# EAGLE design 4WaySwitch (EAGLE 4.13)
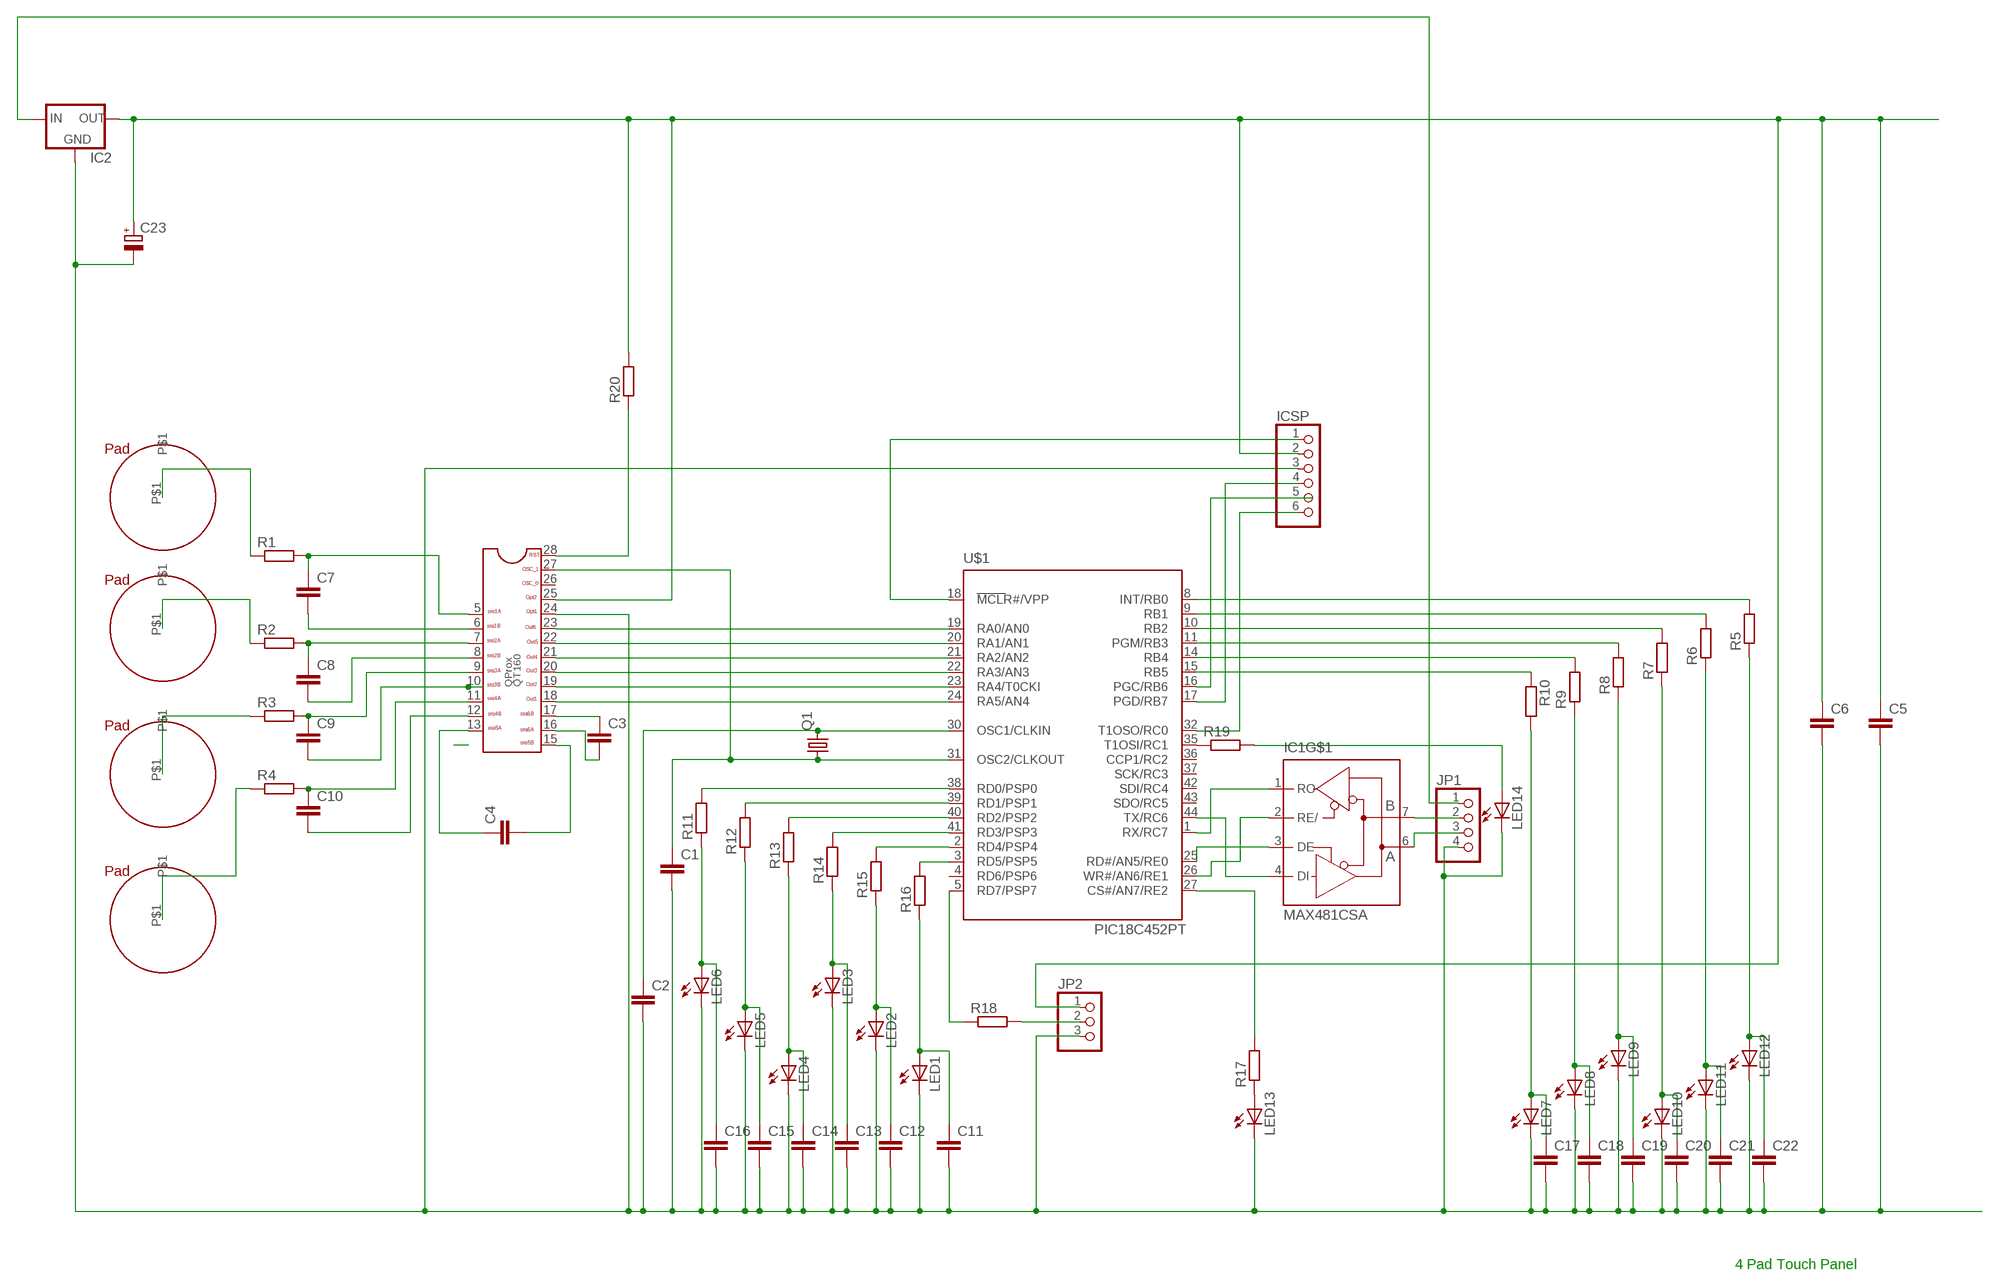
[diagram p0: schematic, sheet 1]

## Parts
C1  C-EUC0805  [C0805]
C2  C-EUC0805  [C0805]
C3  C-EUC0805  [C0805]
C4  C-EUC0805  [C0805]
C5  C-EUC0805  [C0805]
C6  C-EUC0805  [C0805]
C7  C-EUC0805  [C0805]
C8  C-EUC0805  [C0805]
C9  C-EUC0805  [C0805]
C10  C-EUC0805  [C0805]
C11  C-EUC1206  [C1206]
C12  C-EUC1206  [C1206]
C13  C-EUC1206  [C1206]
C14  C-EUC1206  [C1206]
C15  C-EUC1206  [C1206]
C16  C-EUC1206  [C1206]
C17  C-EUC1206  [C1206]
C18  C-EUC1206  [C1206]
C19  C-EUC1206  [C1206]
C20  C-EUC1206  [C1206]
C21  C-EUC1206  [C1206]
C22  C-EUC1206  [C1206]
C23  CPOL-EUD/7343-31W  [D/7343-31W]
IC1  MAX481CSA  [SO08]
IC2  78LXX  [78LXX]
ICSP  PINHD-1X6  [1X06]
JP1  PINHD-1X4  [1X04]
JP2  PINHD-1X3  [1X03]
LED1  LEDSMT1206  [1206]
LED2  LEDSMT1206  [1206]
LED3  LEDCHIPLED_1206  [CHIPLED_1206]
LED4  LEDCHIPLED_1206  [CHIPLED_1206]
LED5  LEDCHIPLED_1206  [CHIPLED_1206]
LED6  LEDCHIPLED_1206  [CHIPLED_1206]
LED7  LEDSMT1206  [1206]
LED8  LEDSMT1206  [1206]
LED9  LEDSMT1206  [1206]
LED10  LEDSMT1206  [1206]
LED11  LEDSMT1206  [1206]
LED12  LEDSMT1206  [1206]
LED13  LED5MM  [LED5MM]
LED14  LEDSMT1206  [1206]
Q1  CRYTALHC49S  [HC49/S]
R1  R-EU_R0805  [R0805]
R2  R-EU_R0805  [R0805]
R3  R-EU_R0805  [R0805]
R4  R-EU_R0805  [R0805]
R5  R-EU_R0805  [R0805]
R6  R-EU_R0805  [R0805]
R7  R-EU_R0805  [R0805]
R8  R-EU_R0805  [R0805]
R9  R-EU_R0805  [R0805]
R10  R-EU_R0805  [R0805]
R11  R-EU_R0805  [R0805]
R12  R-EU_R0805  [R0805]
R13  R-EU_R0805  [R0805]
R14  R-EU_R0805  [R0805]
R15  R-EU_R0805  [R0805]
R16  R-EU_R0805  [R0805]
R17  R-EU_R1206  [R1206]
R18  R-EU_R1210  [R1210]
R19  R-EU_M1206  [M1206]
R20  R-EU_M1206  [M1206]
U$1  PIC18C452PT  [TQFP44]
U$2  QPROX160  [SSOP28]
U$3  PAD  [PAD1]
U$4  PAD  [PAD1]
U$5  PAD  [PAD1]
U$6  PAD  [PAD1]

## Nets
GND: C1.2 C2.2 C5.2 C6.2 C11.2 C12.2 C13.2 C14.2 C15.2 C16.2 C17.2 C18.2 C19.2 C20.2 C21.2 C22.2 C23.- IC2.GND ICSP.3 JP1.4 JP2.3 LED1.C LED2.C LED3.C LED4.C LED5.C LED6.C LED7.C LED8.C LED9.C LED10.C LED11.C LED12.C LED13.K(C) LED14.C U$2.24(OPT1)
N$1: IC1.4(DI) U$1.44(TX/RC6)
N$2: IC1.1(RO) U$1.1(RX/RC7)
N$3: IC1.3(DE) U$1.25(RD#/AN5/RE0)
N$4: IC1.2(RE/) U$1.26(WR#/AN6/RE1)
N$5: U$1.19(RA0/AN0) U$2.23(OUT6)
N$6: U$1.20(RA1/AN1) U$2.22(OUT5)
N$7: U$1.21(RA2/AN2) U$2.21(OUT4)
N$8: U$1.22(RA3/AN3) U$2.20(OUT3)
N$9: U$1.23(RA4/T0CKI) U$2.19(OUT2)
N$10: U$1.24(RA5/AN4) U$2.18(OUT1)
N$11: C2.1 Q1.2 U$1.30(OSC1/CLKIN)
N$12: C1.1 Q1.1 U$1.31(OSC2/CLKOUT) U$2.27(OSCI)
N$13: C3.1 U$2.17(SNS6B)
N$14: C3.2 U$2.16(SNS6A)
N$15: C4.2 U$2.15(SNS5B)
N$16: C4.1 U$2.13(SNS5A)
N$17: R11.2 U$1.38(RD0/PSP0)
N$18: R12.2 U$1.39(RD1/PSP1)
N$19: C7.1 R1.2 U$2.5(SNS1A)
N$20: C7.2 U$2.6(SNS1B)
N$21: C8.1 R2.2 U$2.7(SNS2A)
N$22: C8.2 U$2.8(SNS2B)
N$23: C9.1 R3.2 U$2.9(SNS3A)
N$24: C9.2 U$2.10(SNS3B)
N$25: C10.1 R4.2 U$2.11(SNS4A)
N$26: C10.2 U$2.12(SNS4B)
N$27: R5.2 U$1.8(INT/RB0)
N$28: R6.2 U$1.9(RB1)
N$29: R7.2 U$1.10(RB2)
N$30: R8.2 U$1.11(PGM/RB3)
N$31: R9.2 U$1.14(RB4)
N$32: R10.1 U$1.15(RB5)
N$33: R13.2 U$1.40(RD2/PSP2)
N$34: R14.2 U$1.41(RD3/PSP3)
N$35: R15.2 U$1.2(RD4/PSP4)
N$36: R16.2 U$1.3(RD5/PSP5)
N$37: C11.1 LED1.A R16.1
N$38: C12.1 LED2.A R15.1
N$39: C16.1 LED6.A R11.1
N$40: C15.1 LED5.A R12.1
N$41: C14.1 LED4.A R13.1
N$42: C13.1 LED3.A R14.1
N$43: C17.1 LED7.A R10.2
N$44: C18.1 LED8.A R9.1
N$45: C19.1 LED9.A R8.1
N$46: C20.1 LED10.A R7.1
N$47: C21.1 LED11.A R6.1
N$48: C22.1 LED12.A R5.1
N$49: ICSP.1 U$1.18(MCLR#/VPP)
N$50: R3.1 U$5.P$1
N$51: R1.1 U$3.P$1
N$52: U$1.16(PGC/RB6)
N$53: ICSP.4 U$1.17(PGD/RB7)
N$54: ICSP.6 U$1.32(T1OSO/RC0)
N$55: R2.1 U$4.P$1
N$56: R4.1 U$6.P$1
N$58: IC1.6(A) JP1.3
N$59: IC1.7(B) JP1.2
N$60: R20.1 U$2.28(RST)
N$61: LED13.A R17.1
N$62: R17.2 U$1.27(CS#/AN7/RE2)
N$65: JP2.2 R18.2
N$66: R18.1 U$1.5(RD7/PSP7)
N$67: R19.1 U$1.35(T1OSI/RC1)
N$68: LED14.A R19.2
VCC: C5.1 C6.1 C23.+ IC2.OUT ICSP.2 JP2.1 R20.2 U$2.25(OPT2)
VDD: IC2.IN JP1.1
Unconnected: ICSP.5 U$1.4(RD6/PSP6) U$1.36(CCP1/RC2) U$1.37(SCK/RC3) U$1.42(SDI/RC4) U$1.43(SDO/RC5) U$2.26(OSCO)

## Notes on the sheet
- 4 Pad Touch Panel

## Power pins joined to a net without a drawn wire
GND: IC1.5(GND) U$1.7(GND) U$1.28(GND) U$2.1(GND) U$2.2(GND) U$2.14(GND)
VCC: U$1.6(VCC) U$1.29(VCC) U$2.3(VCC) U$2.4(VCC)
VDD: IC1.8(VDD)

## Library data of the parts
C1-C22 = rcl:C-EU: CAPACITOR, European symbol
C23 = rcl:CPOL-EU: POLARIZED CAPACITOR, European symbol
IC1 = maxim:MAX481CSA: RS485 TRANSEIVER
IC2 = v-reg:78LXX: VOLTAGE REGULATOR
ICSP = pinhead:PINHD-1X6: PIN HEADER
JP1 = pinhead:PINHD-1X4: PIN HEADER
JP2 = pinhead:PINHD-1X3: PIN HEADER
LED1-LED14 = led:LED: LED OSRAM: - CHIPLED LG R971, LG N971, LY N971, LG Q971, LY Q971, LO R971, LY R971 LH N974, LH R974 LS Q976, LO Q976, LY Q976 LO Q996 - Hyper CHIPLED LW Q18S LB Q993, LB Q99A, LB R99A - SideLED LS A670, LO A670, LY A670, LG A670, LP A670 LB A673, LV A673, LT A673, LW A673 LH A674 LY A675 LS A676, LA A676, LO A676, LY A676, LW A676 LS A679, LY A679, LG A679 - Hyper Micro SIDELED® LS Y876, LA Y876, LO Y876, LY Y876 LT Y87S - SmartLED LW L88C, LW L88S LB L89C, LB L89S, LG L890 LS L89K, LO L89K, LY L89K LS L896, LA L896, LO L896, LY L896 - TOPLED LS T670, LO T670, LY T670, LG T670, LP T670 LSG T670, LSP T670, LSY T670, LOP T670, LYG T670 LG T671, LOG T671, LSG T671 LB T673, LV T673, LT T673, LW T673 LH T674 LS T676, LA T676, LO T676, LY T676, LB T676, LH T676, LSB T676, LW T676 LB T67C, LV T67C, LT T67C, LS T67K, LO T67K, LY T67K, LW E67C LS E67B, LA E67B, LO E67B, LY E67B, LB E67C, LV E67C, LT E67C LW T67C LS T679, LY T679, LG T679 LS T770, LO T770, LY T770, LG T770, LP T770 LB T773, LV T773, LT T773, LW T773 LH T774 LS E675, LA E675, LY E675, LS T675 LS T776, LA T776, LO T776, LY T776, LB T776 LHGB T686 LT T68C, LB T68C - Hyper Mini TOPLED® LB M676 - Mini TOPLED Santana® LG M470 LS M47K, LO M47K, LY M47K Source: http://www.osram.convergy.de/
Q1 = crystal:CRYTAL: CRYSTAL
R1-R20 = rcl:R-EU_: RESISTOR, European symbol
U$1 = micro-pic18xxx:PIC18C4*2?: High-Performance Microcontrollers with 10-Bit A/D
U$2 = QProx:QPROX160
U$3-U$6 = QProx:PAD

## Board
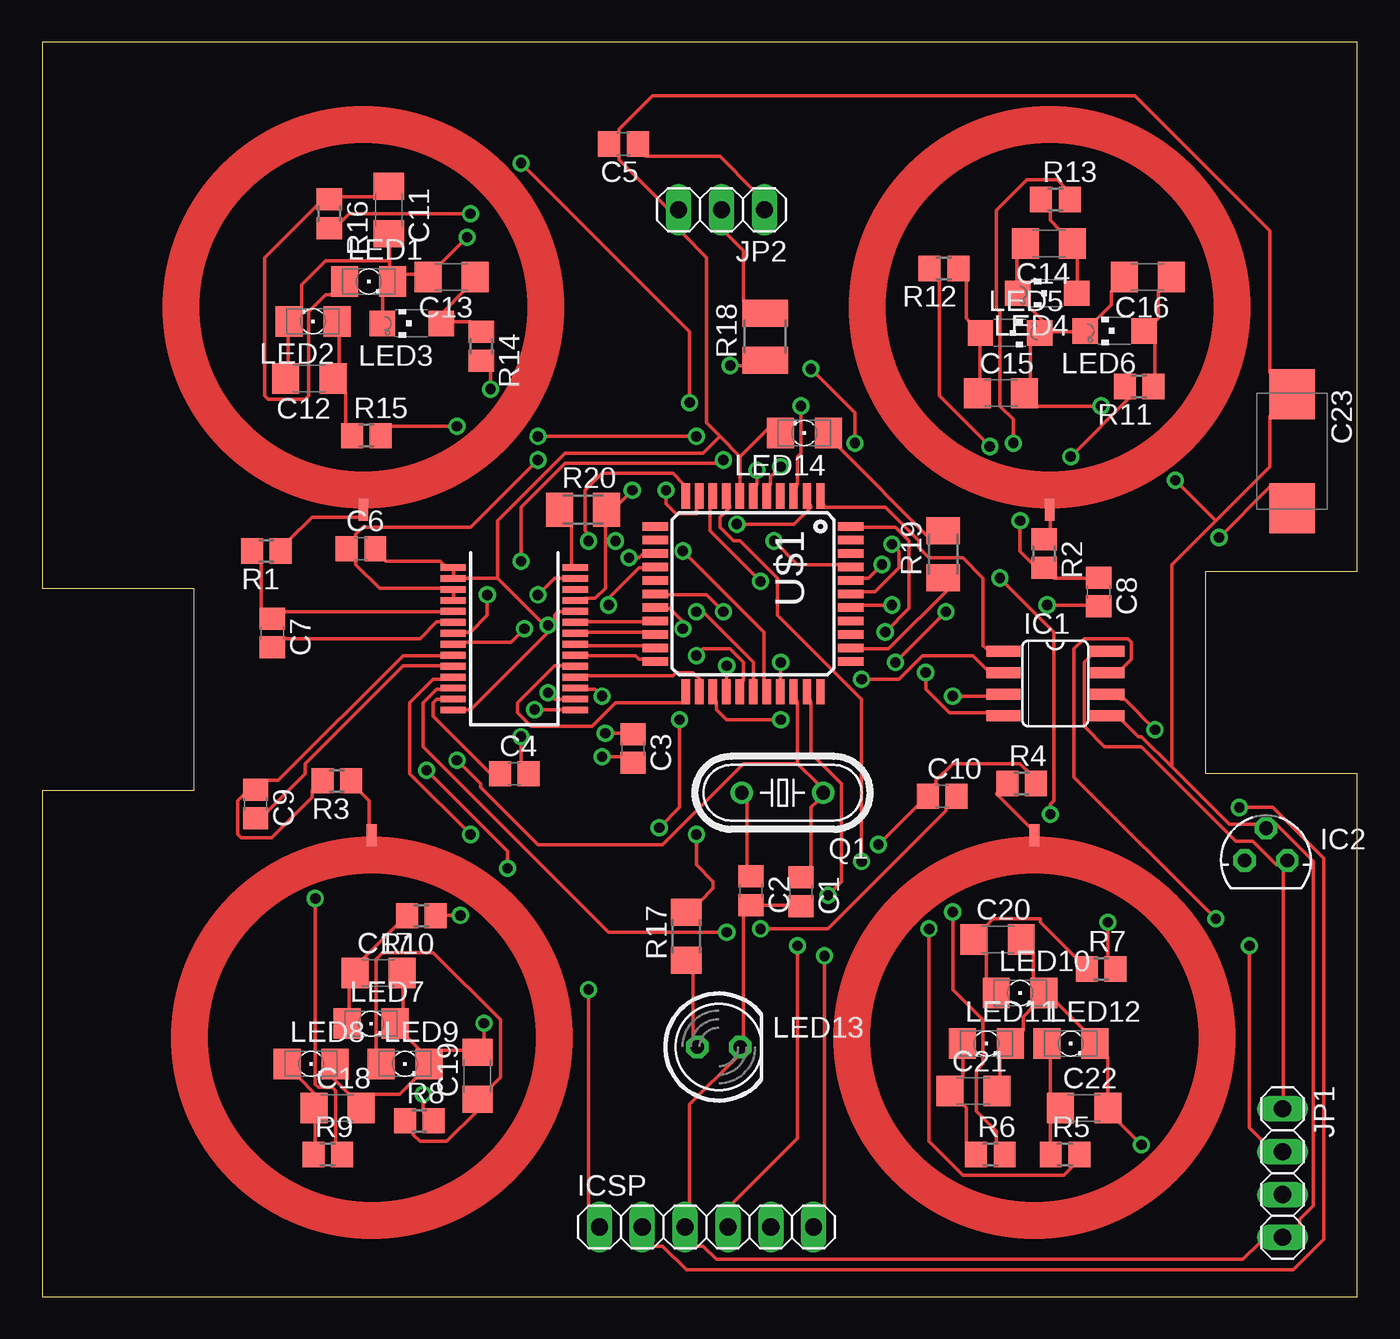
[diagram p1: board, top side]
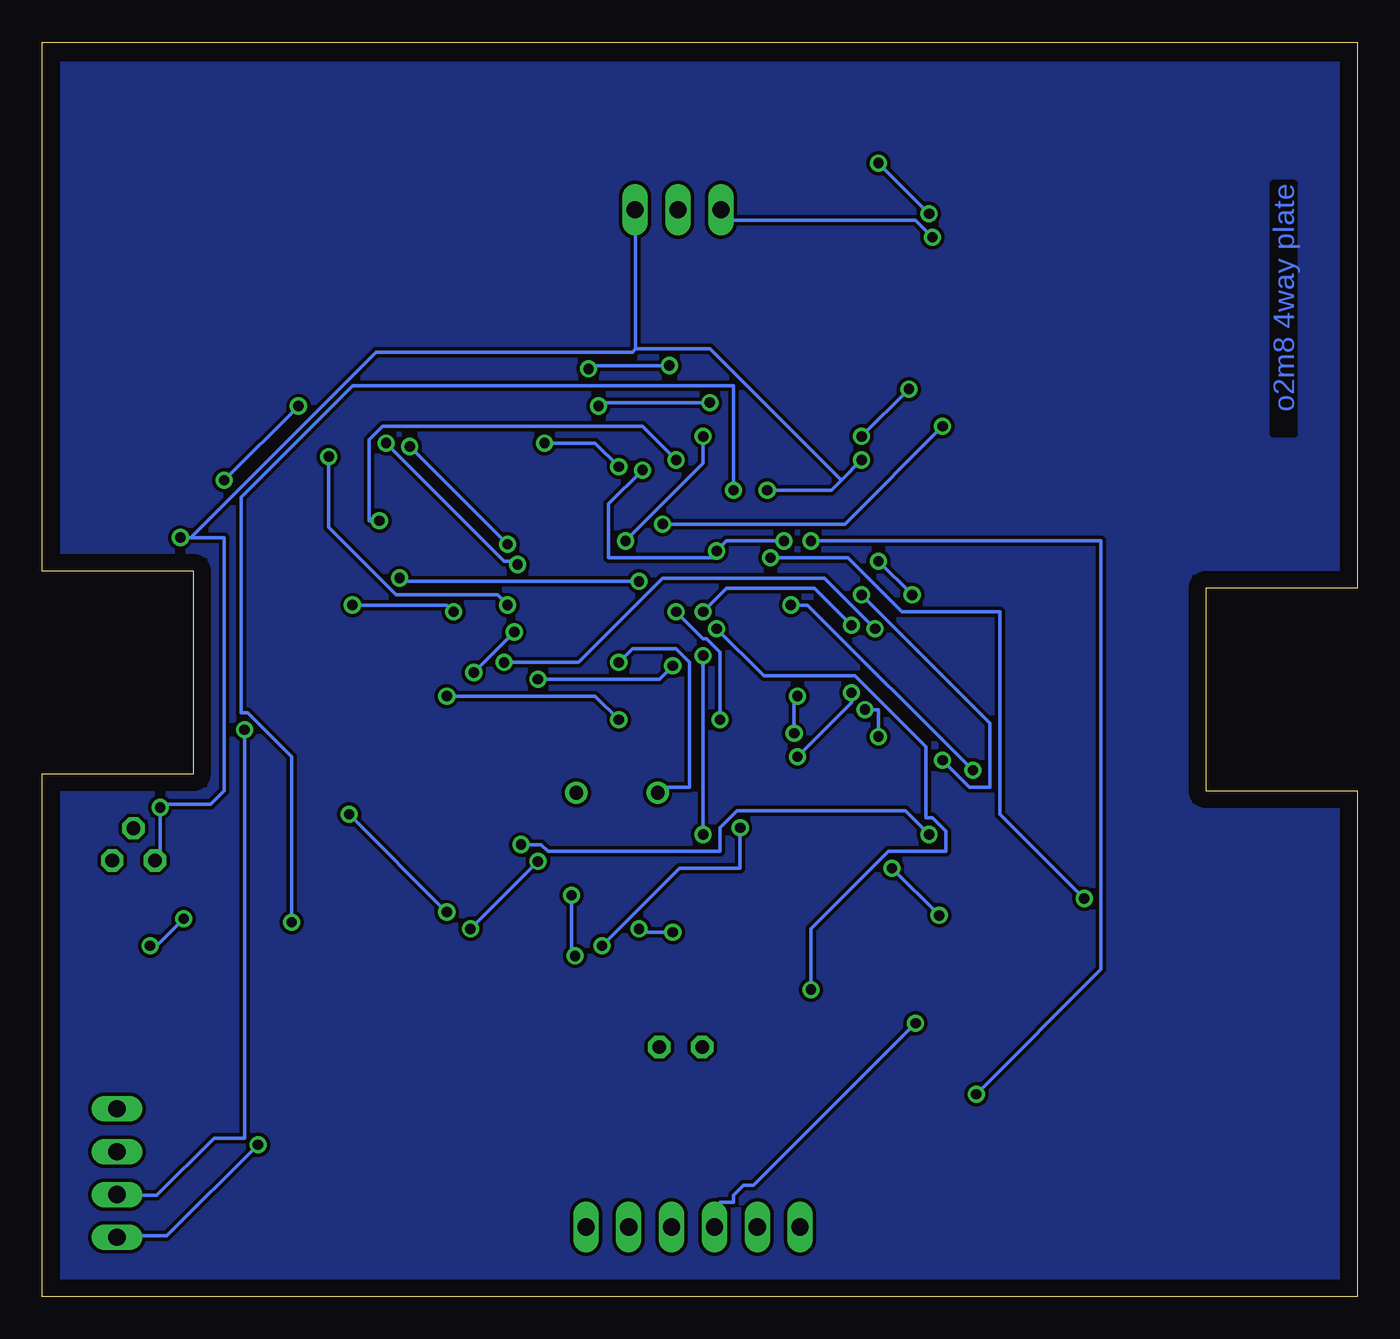
[diagram p2: board, bottom side, seen from below]

Size 78 x 74.37 mm. Coordinates in mm from the lower left corner, seen from the top.
Outline: 0,74.37 78,74.37 78,43 69,43 69,31 78,31 78,0 0,0 0,30 9,30 9,42 0,42 0,74.37
Outline: 0.53,74.37 0,74.37
Copper layers (1*16): Top 0.035mm / dielectric 1.5mm / Bottom 0.035mm
Design rules "default": minimum track width 8mil, minimum drill 24mil, track to track 8mil, track to pad 8mil, pad to pad 8mil, via to via 8mil, smd to smd 8mil, copper to edge 40mil, drill to drill 8mil, minimum pad ring 10mil, minimum via ring 8mil, stop-mask expansion 4mil, vias tented up to drill 0mil, thermal gap 10mil

### Footprints (pad centres in the part's own frame; a part is rotated, then mirrored left to right if it is on the bottom)
C0805 = smd 1.3 x 1.5: 1 -0.85,0; 2 0.85,0
C1206 = smd 1.6 x 1.8: 1 -1.4,0; 2 1.4,0
D/7343-31W = smd 2.95 x 2.7: + 3.375,0; - -3.375,0
SO08 = smd 0.66 x 2.032: 1 -1.905,-3.073; 2 -0.635,-3.073; 3 0.635,-3.073; 4 1.905,-3.073; 5 1.905,3.073; 6 0.635,3.073; 7 -0.635,3.073; 8 -1.905,3.073
78LXX = drill 0.813 octagon: GND 0,1.905; IN 1.27,0; OUT -1.27,0
1X06 = drill 1.016 long: 1 -6.35,0; 2 -3.81,0; 3 -1.27,0; 4 1.27,0; 5 3.81,0; 6 6.35,0
1X04 = drill 1.016 long: 1 -3.81,0; 2 -1.27,0; 3 1.27,0; 4 3.81,0
1X03 = drill 1.016 long: 1 -2.54,0; 2 0,0; 3 2.54,0
1206 = smd 1.6 x 1.803: A -1.422,0; C 1.422,0
CHIPLED_1206 = smd 1.5 x 1.5: A 0,-1.75; C 0,1.75
LED5MM = drill 0.813 octagon: A -1.27,0; K 1.27,0
HC49/S = drill 0.813 round: 1 -2.413,0; 2 2.413,0
R0805 = smd 1.3 x 1.5: 1 -0.85,0; 2 0.85,0
R1206 = smd 1.6 x 1.803: 1 -1.422,0; 2 1.422,0
R1210 = smd 1.6 x 2.7: 1 -1.4,0; 2 1.4,0
M1206 = smd 1.6 x 2: 1 -1.4,0; 2 1.4,0
TQFP44 = smd 1.5 x 0.5: 1 -5.8,4; 2 -5.8,3.2; 3 -5.8,2.4; 4 -5.8,1.6; 5 -5.8,0.8; 6 -5.8,0; 7 -5.8,-0.8; 8 -5.8,-1.6; 9 -5.8,-2.4; 10 -5.8,-3.2; 11 -5.8,-4; 23 5.8,-4; 24 5.8,-3.2; 25 5.8,-2.4; 26 5.8,-1.6; 27 5.8,-0.8; 28 5.8,0; 29 5.8,0.8; 30 5.8,1.6; 31 5.8,2.4; 32 5.8,3.2; 33 5.8,4 | smd 0.5 x 1.5: 12 -4,-5.8; 13 -3.2,-5.8; 14 -2.4,-5.8; 15 -1.6,-5.8; 16 -0.8,-5.8; 17 0,-5.8; 18 0.8,-5.8; 19 1.6,-5.8; 20 2.4,-5.8; 21 3.2,-5.8; 22 4,-5.8; 34 4,5.8; 35 3.2,5.8; 36 2.4,5.8; 37 1.6,5.8; 38 0.8,5.8; 39 0,5.8; 40 -0.8,5.8; 41 -1.6,5.8; 42 -2.4,5.8; 43 -3.2,5.8; 44 -4,5.8
SSOP28 = smd 0.4 x 1.5: 1 -4.225,-3.625; 2 -3.575,-3.625; 3 -2.925,-3.625; 4 -2.275,-3.625; 5 -1.625,-3.625; 6 -0.975,-3.625; 7 -0.325,-3.625; 8 0.325,-3.625; 9 0.975,-3.625; 10 1.625,-3.625; 11 2.275,-3.625; 12 2.925,-3.625; 13 3.575,-3.625; 14 4.225,-3.625; 15 4.225,3.625; 16 3.575,3.625; 17 2.925,3.625; 18 2.275,3.625; 19 1.625,3.625; 20 0.975,3.625; 21 0.325,3.625; 22 -0.325,3.625; 23 -0.975,3.625; 24 -1.625,3.625; 25 -2.275,3.625; 26 -2.925,3.625; 27 -3.575,3.625; 28 -4.225,3.625
PAD1 = smd 0.635 x 1.27: P$1 0,12

### Placement (x,y rotation side)
C1  45,24 270 top
C2  42.04,24.06 270 top
C3  35.04,32.49 270 top
C4  28,31 0 top
C5  34.48,68.34 180 top
C6  18.91,44.34 0 top
C7  13.66,39.34 270 top
C8  62.66,41.77 270 top
C9  12.66,29.2 270 top
C10  53.37,29.66 0 top
C11  20.56,64.42 270 top
C12  15.85,54.44 180 top
C13  24.28,60.44 180 top
C14  59.71,62.44 180 top
C15  56.86,53.56 0 top
C16  65.57,60.44 180 top
C17  19.95,19.18 0 top
C18  17.52,11.18 0 top
C19  25.82,13.09 90 top
C20  56.66,21.18 0 top
C21  55.23,12.18 0 top
C22  61.8,11.18 0 top
C23  74.13,50.12 270 top
IC1  60.08,36.35 270 top
IC2  72.58,25.86 0 top
ICSP  39.4,4.13 0 top
JP1  73.56,7.32 270 top
JP2  40.29,64.44 180 top
LED1  19.37,60.18 0 top
LED2  16.06,57.82 180 top
LED3  21.92,57.7 90 top
LED4  59.6,59.49 90 top
LED5  57.4,57.13 270 top
LED6  63.6,57.25 90 top
LED7  19.51,16.18 0 top
LED8  15.95,13.8 0 top
LED9  21.52,13.8 0 top
LED10  58,18 0 top
LED11  56,15 0 top
LED12  61,15 0 top
LED13  40.13,14.8 0 top
LED14  45.2,51.2 180 top
Q1  43.91,29.87 180 top
R1  13.3,44.2 180 top
R2  59.42,44.05 270 top
R3  17.48,30.58 180 top
R4  58.09,30.42 0 top
R5  60.66,8.42 0 top
R6  56.23,8.42 0 top
R7  62.8,19.42 0 top
R8  22.37,10.42 0 top
R9  16.94,8.42 0 top
R10  22.49,22.58 180 top
R11  65.05,53.96 180 top
R12  53.48,60.96 180 top
R13  60.09,65.04 0 top
R14  26.04,56.34 270 top
R15  19.23,51.04 0 top
R16  17.04,64.2 270 top
R17  38.2,21.37 90 top
R18  42.87,56.91 90 top
R19  53.44,44.01 90 top
R20  32.08,46.65 0 top
U$1  42.16,41.66 270 top
U$2  28,39 270 top
U$3  19.05,58.65 180 top
U$4  59.75,58.65 180 top
U$5  19.55,15.35 0 top
U$6  58.85,15.35 0 top

### Tracks (layer width: path | path; a pad name or v marks a point on that pad's centre or on a via)
GND  (via drill 0.61)
  Top 0.203: C6.2 20.4,43.6 23.6,43.6 23.8,43.4 U$2.1 24.4,43.2 24.4,42.6 U$2.2 25,42.6 27,42.6 | 30.2,39.6 30.4,39.8 30.4,40.4 30.6,40.6 31,40.6 U$2.24 | 30.2,39.6 25.4,34.8 25,34.8 U$2.14 | v38.8,40.6 39.2,40.6 42.2,37.6 42.2,36.6 U$1.28 | 30.2,39.6 v30,39.8 29.6,40 27,42.6 | C12.2 14.6,55.2 14.6,57 LED2.C 15.4,58.6 15.4,60 16.8,61.4 20.6,61.4 | LED3.C 20.2,58.4 20.2,59.4 LED1.C | LED1.C 21.4,60.6 22.2,60.6 C13.2 23.6,61.2 v25.2,62.8 | 20.6,61.4 20.6,61 LED1.C | 20.6,61.4 20.6,62.4 C11.2 | 41.4,49.8 41.4,48.2 U$1.7 | 41.4,49.8 43,51.4 LED14.C | 40.2,51 39.4,51.8 39.4,61.6 38,63 JP2.3 37,64.6 34.2,67.4 34.2,67.6 C5.2 34.2,69 34.2,69.2 36.2,71.2 64.8,71.2 72.8,63.2 72.8,54.8 C23.- 72.8,52.2 72.8,49.2 69.6,46 | 40.2,51 41.4,49.8 | 27,42.6 27,46 31,50 39.2,50 40.2,51 | LED8.C 17.2,13 18.2,12 C18.2 19.6,12 21.2,12 22.2,13 LED9.C | C17.2 21.4,18.4 21.4,17 LED7.C 21.6,15.4 22.4,14.6 LED9.C | LED9.C 23.6,14.6 25,14.6 C19.2 26.2,15.2 v26.2,16.2 | C1.2 44.4,23.2 42.6,23.2 C2.2 41.6,22.6 41.6,15.4 LED13.K 41.2,14.2 38.4,11.4 38.4,5.6 ICSP.3 38.8,3 39.2,3 40,2.2 71.2,2.2 72.2,3.2 JP1.4 74.6,4.2 74.6,4.6 75.4,5.4 75.4,25.8 73.2,28 IC2.GND 72,28 70.4,28 67,31.4 | C21.2 56.8,13 56.8,14.2 LED11.C 58.2,15.8 58.2,16.6 58.8,17.2 LED10.C | C20.2 58.8,20.4 58.8,18.8 LED10.C | LED10.C 60.2,17.4 61.8,15.8 LED12.C 63.2,14.2 C22.2 63.8,10.4 v65.2,9 | C14.2 57.8,61.6 57.8,60.2 LED4.C 58.4,58.8 59.4,57.8 LED5.C | LED5.C 59.8,57.2 61.2,57.2 LED6.C 63.4,58.8 63.4,59.6 C16.2 | LED5.C 58.6,56.4 58.6,54.4 C15.2 59,52.8 v62.8,52.8 | 67,31.4 65.2,33.2 65,33.2 64,34.2 IC1.5 | 69.6,46 67,43.4 67,31.4
  Top 0.203: 69.6,46 v67.2,48.4
  Bottom 0.203: v38.8,40.6 37.4,42 32.2,42 v30,39.8 | v25.2,62.8 26.2,63.8 37,63.8 JP2.3 | v26.2,16.2 35.8,6.6 36.4,6.6 37,6 37,5.6 37.8,5.6 ICSP.3 | v67.2,48.4 v62.8,52.8 | v65.2,9 70.6,3.6 72.2,3.6 JP1.4
N$1  (via drill 0.61)
  Top 0.203: v50,39.4 51.4,40.8 51.4,44.8 50.6,45.6 48.6,45.6 U$1.44 | v52.4,37 52.4,36 53.8,34.6 56,34.6 IC1.4
  Bottom 0.203: v52.4,37 v50,39.4
N$2
  Top 0.203: U$1.1 46.4,46.8 50,46.8 52,44.8 52,44.4 52.6,43.8 54.6,43.8 55.8,42.6 55.8,38.6 56,38.4 IC1.1
N$3  (via drill 0.61)
  Top 0.203: v43.8,34.2 40.6,34.2 40,34.8 40,35.2 U$1.25 | v54,35.6 56,35.6 IC1.3
  Bottom 0.203: v43.8,34.2 45.2,35.6 v54,35.6
N$4  (via drill 0.61)
  Top 0.203: v40.6,37.4 40.6,36.6 U$1.26 | v48.6,36.6 50.8,36.6 52.2,38 55.2,38 56,37.2 IC1.2
  Bottom 0.203: v40.6,37.4 41.4,36.6 v48.6,36.6
N$5
  Top 0.203: U$2.23 32.2,40 35.8,40 U$1.19
N$6
  Top 0.203: U$2.22 32.2,39.4 35.8,39.4 U$1.20
N$7
  Top 0.203: U$2.21 32.2,38.6 35.8,38.6 U$1.21
N$8
  Top 0.203: U$2.20 32.2,38 35.2,38 35.4,37.8 35.8,37.8 U$1.22
N$9
  Top 0.203: U$1.23 38,35.2 34,35.2 32.6,33.8 29,33.8 28.2,34.6 28.2,35.2 30.4,37.4 31,37.4 U$2.19
N$10
  Top 0.203: U$2.18 32.2,36.8 37.4,36.8 37.6,37 38.6,37 39,36.6 U$1.24
N$11  (via drill 0.61)
  Top 0.203: C2.1 41.8,25.4 41.8,29.4 Q1.2 | v43.8,37.6 43.8,36.6 U$1.30
  Bottom 0.203: v43.8,37.6 43,38.4 40.4,38.4 39.6,37.6 39.6,30.2 41,30.2 Q1.2
N$12  (via drill 0.61)
  Top 0.203: C1.1 45.6,25.4 45.6,29 46,29.4 Q1.1 46,30.4 44.8,31.6 | 44.8,31.6 44.8,35.2 U$1.31 | v29.4,41.6 30.4,42.6 31,42.6 U$2.27 | v24.6,31.8 26,30.4 26,30.2 29.4,26.8 36.8,26.8 41.6,31.6 44.8,31.6
  Bottom 0.203: v29.4,41.6 21.8,34 21.8,30.2 23,30.2 v24.6,31.8
N$13  (via drill 0.61)
  Top 0.203: v33.4,33.4 34.4,33.4 C3.1 | v33.2,35.6 32.8,36 32.2,36 U$2.17
  Bottom 0.203: v33.4,33.4 33.4,35.6 v33.2,35.6
N$14  (via drill 0.61)
  Top 0.203: v30,35.8 30.4,35.4 31,35.4 U$2.16 | v33.2,32 34.4,32 C3.2
  Bottom 0.203: v30,35.8 30,35.2 v33.2,32
N$15  (via drill 0.61)
  Top 0.203: v28.4,33.2 28.4,31.6 C4.2 | v29.2,34.8 31,34.8 U$2.15
  Bottom 0.203: v28.4,33.2 28.4,34.8 v29.2,34.8
N$16
  Top 0.203: U$2.13 23.8,35.4 23.4,35.4 23.2,35.2 23.2,34.4 26.6,31 C4.1
N$17  (via drill 0.61)
  Top 0.203: v50.4,41 48.6,41 U$1.38 | v61,49.8 64.6,53.4 R11.2
  Bottom 0.203: v50.4,41 51,41.6 57,41.6 61,45.6 v61,49.8
N$18  (via drill 0.61)
  Top 0.203: v50.4,44.6 50.8,44.2 50.8,43.2 49.4,41.8 48.6,41.8 U$1.39 | v56.2,50.4 53.2,53.4 53.2,60.4 R12.2
  Bottom 0.203: v50.4,44.6 v56.2,50.4
N$19
  Top 0.203: R1.2 13,43.6 13,40.8 C7.1 14.4,40.6 23.8,40.6 U$2.5
N$20
  Top 0.203: C7.2 14.4,39 22.4,39 23.4,40 23.8,40 U$2.6
N$21  (via drill 0.61)
  Top 0.203: v26.4,41.6 26.4,40.4 25.4,39.4 25,39.4 U$2.7 | v28.4,43.6 28.4,46.8 31,49.4 40.2,49.4 v40.4,49.6 | v58,46 58,44.2 58.8,43.4 R2.2 60,42.6 62,42.6 C8.1
  Bottom 0.203: v26.4,41.6 v28.4,43.6 | v40.4,49.6 42.4,51.6 57.8,51.6 58.6,50.8 58.6,46 v58,46
N$22  (via drill 0.61)
  Top 0.203: v28.6,39.6 27.8,38.8 25,38.8 U$2.8 | v50.6,37.6 v53.6,40.6 | v59.6,41 62,41 C8.2
  Bottom 0.203: v28.6,39.6 31.6,42.6 41.2,42.6 46.2,37.6 v50.6,37.6 | v53.6,40.6 54,41 v59.6,41
N$23
  Top 0.203: U$2.9 23.8,38 21.4,38 14,30.6 13.4,30.6 C9.1 12,29.8 11.6,29.4 11.6,27.4 11.8,27.2 13.6,27.2 16,29.6 16,30 R3.2
N$24
  Top 0.203: C9.2 13.4,28.8 15.6,31 15.6,31.6 21.4,37.4 23.8,37.4 U$2.10
N$25  (via drill 0.61)
  Top 0.203: R4.2 58.6,31 58,31.6 54,31.6 53,30.6 53,30.4 C10.1 52,29.2 v49.6,26.8 | v25.4,27.4 21.8,31 21.8,35.2 23.2,36.6 23.8,36.6 U$2.11
  Bottom 0.203: v25.4,27.4 26.8,28.8 36.8,28.8 37.8,27.8 37.8,26.4 48,26.4 48.4,26.8 v49.6,26.8
N$26  (via drill 0.61)
  Top 0.203: v42.6,21.8 46.6,21.8 53.6,28.8 53.6,29 C10.2 | v40.6,21.6 33.6,21.6 22.6,32.6 22.6,35.2 23.4,36 23.8,36 U$2.12
  Bottom 0.203: v42.6,21.8 42.4,21.6 v40.6,21.6
N$27  (via drill 0.61)
  Top 0.203: v52.6,21.8 52.6,9.2 54.6,7.2 60.6,7.2 61,7.6 61,7.8 R5.2 | v48.6,25.8 48.6,35.4 43.6,40.4 43.6,42.6 41.4,44.8 41,44.8 40.2,45.6 40.2,46.2 40.8,46.8 U$1.8
  Bottom 0.203: v52.6,21.8 v48.6,25.8
N$28  (via drill 0.61)
  Top 0.203: v54,22.8 54,18.2 55.8,16.4 55.8,13.8 55.4,13.4 55.4,11 56.6,9.8 56.6,9 R6.2 | v59.8,28.6 59.8,29.2 60,29.4 60,39.4 v56.8,42.6 | v42.6,42.4 39.6,45.4 39.6,46.8 U$1.9
  Bottom 0.203: v54,22.8 v59.8,28.6 | v56.8,42.6 56.6,42.4 v42.6,42.4
N$29  (via drill 0.61)
  Top 0.203: v37,47.8 37,47 37.6,46.4 38.8,46.4 38.8,46.8 U$1.10 | v63.2,22.2 63.2,20 R7.2
  Bottom 0.203: v37,47.8 37,54 59.6,54 66.2,47.4 66.2,34.6 65.8,34.6 63.2,32 v63.2,22.2
N$30  (via drill 0.61)
  Top 0.203: v22.6,12 22.6,11 R8.2 | v32.4,44.8 32.4,45.2 32.2,45.4 32.2,47.8 33.2,48.8 37.4,48.8 38,48.2 U$1.11
  Bottom 0.203: v22.6,12 15.2,19.4 15.2,44.8 v32.4,44.8
N$31  (via drill 0.61)
  Top 0.203: v16.2,23.6 16.2,12.6 16.4,12.4 17.2,12.4 17.4,12.2 17.4,9 R9.2 | v34.8,43.8 35.4,43.8 35.8,44.2 U$1.14
  Bottom 0.203: v16.2,23.6 21.2,28.6 21.2,40.6 27,40.6 30.2,43.8 v34.8,43.8
N$32  (via drill 0.61)
  Top 0.203: v24.8,22.6 23.8,22.6 R10.1 | v27.6,25.4 27.6,26.4 v22.8,31.2 | v33.6,41 33.6,41.4 35.4,43.2 35.8,43.2 U$1.15
  Bottom 0.203: v24.8,22.6 v27.6,25.4 | v22.8,31.2 32.6,41 v33.6,41
N$33  (via drill 0.61)
  Top 0.203: v49.8,43.4 49,42.6 48.6,42.6 U$1.40 | v57.6,50.6 57.6,52 56.8,52.8 56.8,58.4 56.6,58.6 56.6,64.4 58.4,66.2 60.2,66.2 60.8,65.6 R13.2
  Bottom 0.203: v49.8,43.4 50,43.6 50.6,43.6 v57.6,50.6
N$34  (via drill 0.61)
  Top 0.203: v43.4,44.8 44.8,43.4 47.4,43.4 U$1.41 | v29.4,51 v38.8,51 | v26.6,53.8 26.6,55 R14.2
  Bottom 0.203: v43.4,44.8 38.8,49.4 v38.8,51 | v26.6,53.8 v29.4,51
N$35  (via drill 0.61)
  Top 0.203: v24.6,51.6 20.6,51.6 R15.2 | v41.2,45.8 44.6,45.8 45.6,46.8 U$1.2
  Bottom 0.203: v24.6,51.6 30.4,45.8 v41.2,45.8
N$36  (via drill 0.61)
  Top 0.203: v45,52.8 45,50 44.8,49.8 44.8,48.2 U$1.3 | v38.4,53 38.4,57.2 v28.4,67.2 | v25.4,64.2 18.2,64.2 17.6,63.6 R16.2
  Bottom 0.203: v45,52.8 44.8,53 v38.4,53 | v25.4,64.2 v28.4,67.2
N$37
  Top 0.203: C11.1 19.8,65.2 17.6,65.2 R16.1 16.4,64.8 13.2,61.6 13.2,53.4 13.4,53.2 15.6,53.2 15.8,53.4 15.8,58.4 16.8,59.4 17.2,59.4 LED1.A
N$38
  Top 0.203: R15.1 18,51.6 18,53.6 C12.1 17.6,55.2 17.6,57 LED2.A
N$39
  Top 0.203: R11.1 66,54.6 66,56.6 LED6.A 66,57.8 66.2,58 66.2,59.6 C16.1
N$40
  Top 0.203: C15.1 55.6,54.4 55.6,56.4 LED5.A 55,57.8 54.8,58 54.8,60.4 R12.1
N$41
  Top 0.203: LED4.A 61.4,60.2 61.4,61.6 C14.1 60.4,63.2 59.8,63.8 59.8,64.4 R13.1
N$42
  Top 0.203: R14.1 25.4,57.8 24.4,57.8 LED3.A 23.8,58.4 25,59.6 C13.1
N$43
  Top 0.203: R10.2 21,22 19,20 C17.1 18.2,18.4 18.2,17 LED7.A
N$44
  Top 0.203: R9.1 16.2,9 16.2,10.4 C18.1 16.2,12 15.2,13 LED8.A
N$45
  Top 0.203: R8.1 22,9.8 22,9.6 22.4,9.2 24,9.2 25.8,11 C19.1 26.6,12.4 27.2,13 27.2,16.4 23.2,20.4 20.2,20.4 19.8,20 19.8,14.6 LED9.A
N$46
  Top 0.203: R7.1 61.4,20 59.2,22.2 59.2,22.4 56.4,22.4 56,22 C20.1 56,20.4 56,18.8 LED10.A
N$47
  Top 0.203: R6.1 54.8,9 54.8,11.2 54.6,11.4 C21.1 54.6,13 54.6,14.2 LED11.A
N$48
  Top 0.203: R5.1 59.8,9 59.8,10.4 C22.1 59.8,12 59.8,14.2 LED12.A
N$49  (via drill 0.61)
  Top 0.203: v38,39.6 38,40 37.2,40.8 37,40.8 U$1.18 | v32.4,18.2 32.4,5.2 ICSP.1
  Bottom 0.203: v38,39.6 35.2,36.8 29.8,36.8 25.6,32.6 25.6,28.4 25.2,28.4 24.4,27.6 24.4,26.4 27.8,26.4 32.4,21.8 v32.4,18.2
N$50
  Top 0.203: U$5.P$1 19.4,27.8 19.4,29.4 18.8,30 R3.1
N$51
  Top 0.203: U$3.P$1 18.8,46.2 16,46.2 14.6,44.8 R1.1
N$53  (via drill 0.61)
  Top 0.203: v40.4,40.6 39.4,41.6 37,41.6 U$1.17 | v37.8,34.2 37.8,29 v36.6,27.8 | v44.8,20.8 44.8,9.4 41,5.6 ICSP.4
  Bottom 0.203: v40.4,40.6 38.8,39 38.6,39 37.8,38.2 v37.8,34.2 | v36.6,27.8 36.6,25.4 40.2,25.4 v44.8,20.8
N$54  (via drill 0.61)
  Top 0.203: v46.6,23.8 47.4,24.6 47.4,30.4 45.6,32.2 45.6,35.2 U$1.32 | v46.4,20.2 46.4,5.2 ICSP.6
  Bottom 0.203: v46.6,23.8 46.6,20.2 v46.4,20.2
N$55
  Top 0.203: U$4.P$1 59.8,46.2 59.8,45.4 R2.1
N$56
  Top 0.203: U$6.P$1 58.6,27.8 56.6,29.8 R4.1
N$58  (via drill 0.61)
  Top 0.203: v66,33.6 64.2,35.4 64,35.4 IC1.6
  Bottom 0.203: v66,33.6 66,9.4 67.8,9.4 71.2,6 72.2,6 JP1.3
N$59  (via drill 0.61)
  Top 0.203: v69.6,22.4 61.2,30.8 61.2,38.4 61.8,39 64.4,39 64.6,38.8 64.6,37.8 64,37.2 IC1.7 | v71.6,20.8 71.6,10 72.4,9.2 JP1.2
  Bottom 0.203: v69.6,22.4 71.2,20.8 v71.6,20.8
N$60
  Top 0.203: U$2.28 31.4,43.4 31.4,45.8 R20.1
N$61
  Top 0.203: R17.1 38.6,19.2 38.6,15.4 LED13.A
N$62  (via drill 0.61)
  Top 0.203: v38.8,38 39.2,38.4 40.8,38.4 41.6,37.6 41.6,36.6 U$1.27 | v38.8,27.4 38.8,25.6 39.8,24.6 39.8,24.2 39,23.4 R17.2
  Bottom 0.203: v38.8,27.4 v38.8,38
N$65
  Top 0.203: R18.2 41.6,59 41.6,62 40.6,63 JP2.2
N$66  (via drill 0.61)
  Top 0.203: v43.8,49.2 43.2,48.6 43.2,48.2 U$1.5 | v48.2,50.6 48.2,52.4 v45.6,55 | v40.8,55.2 41.6,55.2 R18.1
  Bottom 0.203: v43.8,49.2 45.2,50.6 v48.2,50.6 | v45.6,55 45.4,55.2 v40.8,55.2
N$67
  Top 0.203: U$1.35 48.6,38.4 50.2,38.4 53.8,42 R19.1
N$68
  Top 0.203: LED14.A 47.2,50.4 52.6,45 R19.2
VCC  (via drill 0.61)
  Top 0.203: C5.1 35.8,67.6 40.2,67.6 42.2,65.6 JP2.1 | U$2.4 24.4,41.4 24.4,41.8 U$2.3 23.8,42 20,42 18.6,43.4 18.6,43.6 C6.1 18.6,45 18.6,45.2 19,45.6 25.4,45.6 v29.4,49.6 | 33.4,44.8 33.4,45.8 R20.2 34.2,47 v35,47.8 | 33.4,44.8 33.4,42 32.8,41.4 32.2,41.4 U$2.25 | v38,44.2 42.8,39.4 42.8,36.6 U$1.29 | 33.4,44.8 v34,44.8 | v42.4,49 42.4,48.2 U$1.6 | v69.8,45 72.8,48 C23.+ | v71,29 73,29 76,26 76,3.4 74.2,1.6 38.2,1.6 36.8,3 36.2,3 ICSP.2
  Bottom 0.203: v34,44.8 37.4,44.8 v38,44.2 38.2,43.8 44.4,43.8 44.4,47 v42.4,49 | 30.6,48.4 31.2,47.8 v35,47.8 | 30.6,48.4 v29.4,49.6 | 42.8,56.2 42.8,63 JP2.1 | 42.8,56.2 38.4,56.2 30.6,48.4 | 69.2,45 v69.8,45 | 69.2,45 67.2,45 67.2,30 68,29.2 71,29.2 v71,29 71,26.4 IC2.OUT | 42.8,56.2 43,56 58.2,56 69.2,45
VDD
  Top 0.203: IC1.8 62.2,38 61.8,37.6 61.8,33.8 63,32.6 65.2,32.6 70.8,27 71.8,27 73.2,25.6 IC2.IN 73.6,25.2 73.6,11.8 JP1.1
VSS
  pour Bottom: 1,1 1,29 10,29 10,43 1,43 1,73 77,73 77,44 68,44 68,30 77,30 77,1

### Text on the board
Bottom: o2m8 4way plate